# Altium project Inverter.PrjPcb
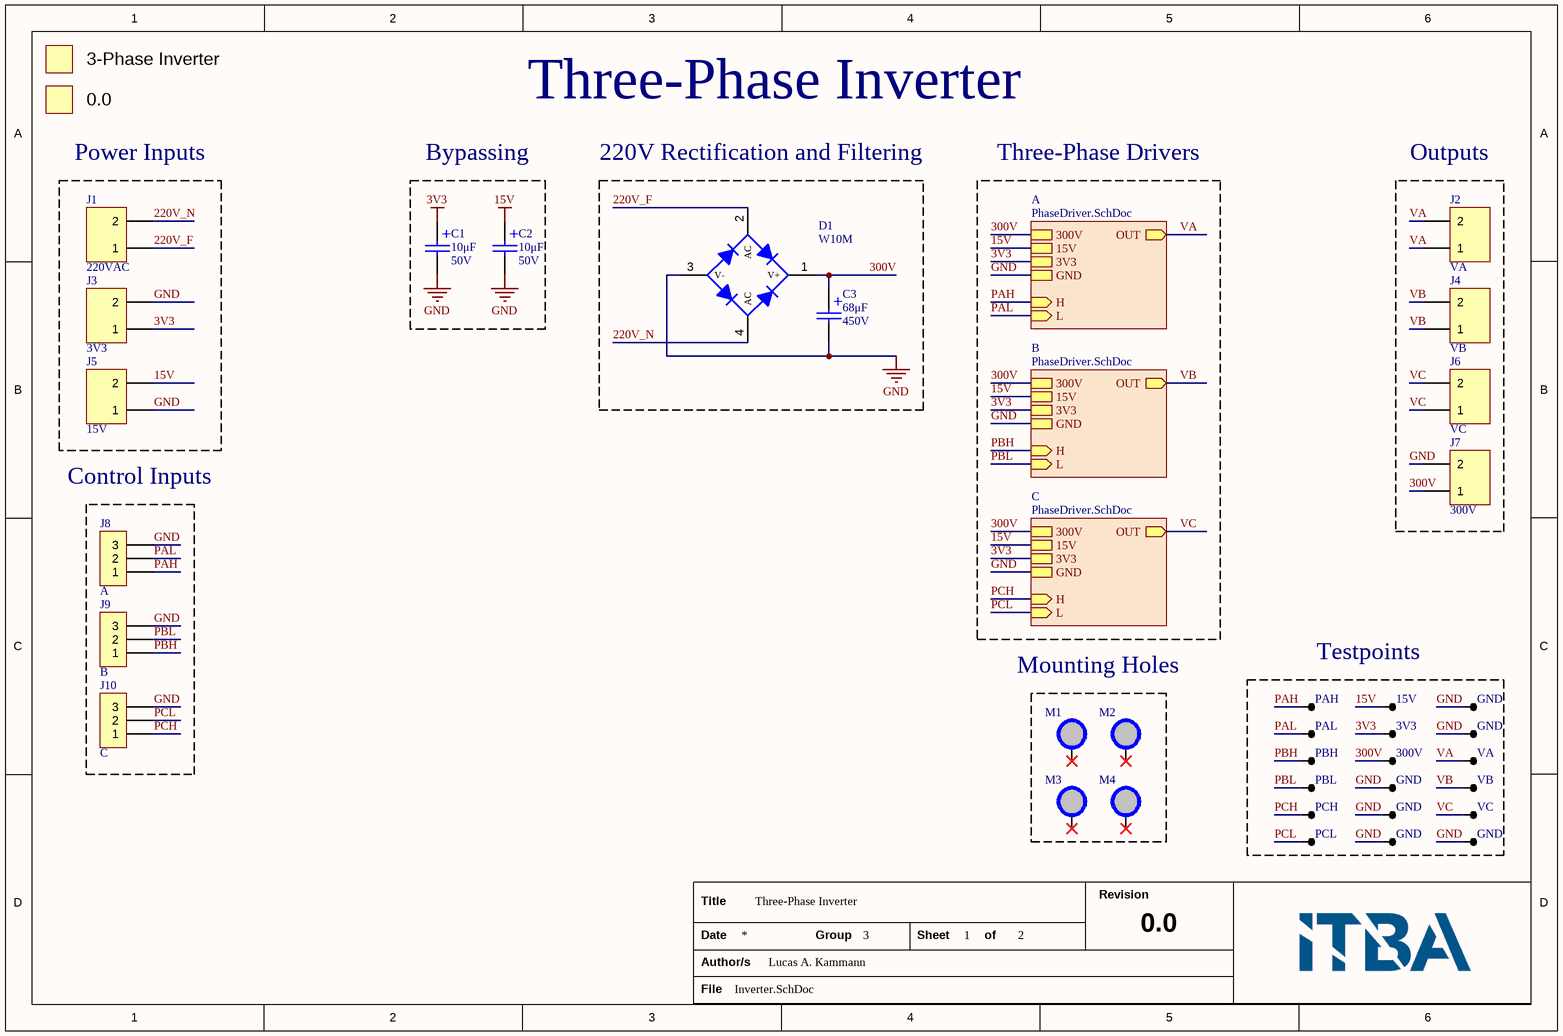
[diagram p0: Inverter.SchDoc]
2 sheets, 77 parts. Net scope: strictly hierarchical (ports join the sheet entries above them; power ports are local).
Board file: Inverter.PcbDoc
Sheets:
  Inverter.SchDoc
    A = PhaseDriver.SchDoc
    B = PhaseDriver.SchDoc
    C = PhaseDriver.SchDoc

## Sheet Inverter.SchDoc: Three-Phase Inverter
size 292 x 193 mm; Author: Lucas A. Kammann; DrawnBy: Lucas A. Kammann; Revision: 0.0; SheetNumber: 1; SheetTotal: 2; Project: Three-Phase Inverter; Authors: Lucas A. Kammann; Group: 3

### Parts
B1  Name: 3-Phase Inverter  [MISC_BOARD]  (hidden comment: Board Name)  (no BOM)
C1  value 10μF  Voltage Rating: 50V  [CAP100RP]  (hidden comment: CAPPOL)
C2  value 10μF  Voltage Rating: 50V  [CAP100RP]  (hidden comment: CAPPOL)
C3  value 68μF  Voltage Rating: 450V  [CAP_8mm]  (hidden comment: CAPPOL)
D1  W10M  [PUENTE - W10M]
J1  220VAC  [BORNERA2]
J2  VA  [BORNERA2]
J3  3V3  [BORNERA2]
J4  VB  [BORNERA2]
J5  15V  [BORNERA2]
J6  VC  [BORNERA2]
J7  300V  [BORNERA2]
J8  A  [SIP3]
J9  B  [SIP3]
J10  C  [SIP3]
M1  Mounting Hole  [MISC_MOUNTING_HOLE_M3]  (value not drawn)  (no BOM)
M2  Mounting Hole  [MISC_MOUNTING_HOLE_M3]  (value not drawn)  (no BOM)
M3  Mounting Hole  [MISC_MOUNTING_HOLE_M3]  (value not drawn)  (no BOM)
M4  Mounting Hole  [MISC_MOUNTING_HOLE_M3]  (value not drawn)  (no BOM)
TP1  PAH  [TPTH]
TP2  15V  [TPTH]
TP3  GND  [TPTH]
TP4  PAL  [TPTH]
TP5  3V3  [TPTH]
TP6  GND  [TPTH]
TP7  PBH  [TPTH]
TP8  300V  [TPTH]
TP9  VA  [TPTH]
TP10  PBL  [TPTH]
TP11  GND  [TPTH]
TP12  VB  [TPTH]
TP13  PCH  [TPTH]
TP14  GND  [TPTH]
TP15  VC  [TPTH]
TP16  PCL  [TPTH]
TP17  GND  [TPTH]
TP18  GND  [TPTH]
V1  Version: 0.0  [MISC_VERSION]  (hidden comment: PCB Version)  (no BOM)

### Blocks framed on the sheet
Power Inputs: J1 J3 J5
Bypassing: C1 C2
220V Rectification and Filtering: C3 D1
Outputs: J2 J4 J6 J7
Control Inputs: J8-J10
Mounting Holes: M1-M4
Testpoints: TP1-TP18

### Sub-sheets
A = PhaseDriver.SchDoc: 15V, 3V3, GND, H (in), L (in), OUT (out), 300V
B = PhaseDriver.SchDoc: 15V, 3V3, GND, H (in), L (in), OUT (out), 300V
C = PhaseDriver.SchDoc: 15V, 3V3, GND, H (in), L (in), OUT (out), 300V

### Nets
3V3: C1.1 J3.1 TP5.1 ; sheet A/3V3, sheet B/3V3, sheet C/3V3
15V: C2.1 J5.2 TP2.1 ; sheet A/15V, sheet B/15V, sheet C/15V
300V: C3.1 D1.1(V+) J7.1 TP8.1 ; sheet A/300V, sheet B/300V, sheet C/300V
GND: C1.2 C2.2 C3.2 D1.3(V-) J3.2 J5.1 J7.2 J8.3 J9.3 J10.3 TP3.1 TP6.1 TP11.1 TP14.1 TP17.1 TP18.1 ; sheet A/GND, sheet B/GND, sheet C/GND
220V_F: D1.2(AC) J1.1
220V_N: D1.4(AC) J1.2
PAH: J8.1 TP1.1 ; sheet A/H
PAL: J8.2 TP4.1 ; sheet A/L
PBH: J9.1 TP7.1 ; sheet B/H
PBL: J9.2 TP10.1 ; sheet B/L
PCH: J10.1 TP13.1 ; sheet C/H
PCL: J10.2 TP16.1 ; sheet C/L
VA: J2.1 J2.2 TP9.1 ; sheet A/OUT
VB: J4.1 J4.2 TP12.1 ; sheet B/OUT
VC: J6.1 J6.2 TP15.1 ; sheet C/OUT

Not connected (* = marked no-connect by the designer): M1 1*; M2 1*; M3 1*; M4 1*

### Notes on the sheet
- Three-Phase Inverter
- Three-Phase Drivers
- Title
- Revision
- Date
- Author/s
- Group
- Sheet
- of
- File
- (in symbol CAPACITOR POLARIZADO) +

### Library data of the parts
B1 = MISC_BOARD
C1-C3 = CAPACITOR POLARIZADO: Manufacturer Part Number: -; Manufacturer: -
J1-J7 = BORNERA 2: BORNERA 2 POLOS; Manufacturer Part Number: -; Manufacturer: -
J8-J10 = CON3
M1-M4 = MISC_MOUNTING_HOLE_M3: MOUNTING HOLE M2.5
TP1-TP18 = TP: TESTPOINT
V1 = MISC_VERSION

## Sheet PhaseDriver.SchDoc: Phase Driver
size 292 x 193 mm; Revision: 1.0; SheetNumber: 2; SheetTotal: 2; Project: Inverter
Used 3 times, as channels A, B, C. Parts and nets are listed once, with the designators drawn on the sheet.
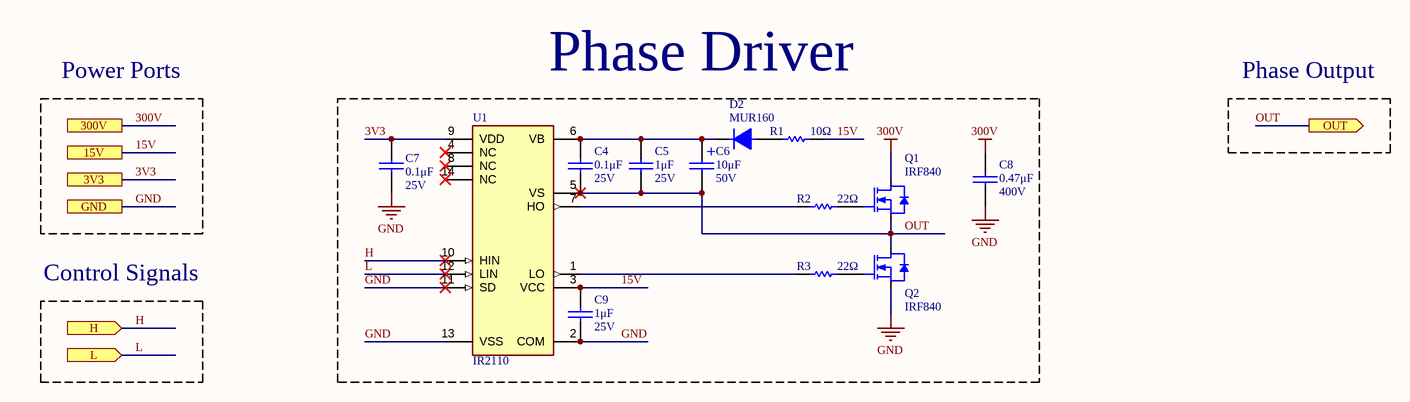
[diagram p1: PhaseDriver.SchDoc]

### Parts
C4  value 0.1μF  Voltage Rating: 25V  [0805]  (hidden comment: CAP)
C5  value 1μF  Voltage Rating: 25V  [CAP100]  (hidden comment: CAP)
C6  value 10μF  Voltage Rating: 50V  [CAP100RP]  (hidden comment: CAPPOL)
C7  value 0.1μF  Voltage Rating: 25V  [0805]  (hidden comment: CAP)
C8  value 0.47μF  Voltage Rating: 400V  [CAP600]  (hidden comment: CAP)
C9  value 1μF  Voltage Rating: 25V  [CAP100]  (hidden comment: CAP)
D2  MUR160  [DO41]
Q1  IRF840  [TO-220 V]
Q2  IRF840  [TO-220 V]
R1  value 10Ω  [0805]  (hidden comment: RES)
R2  value 22Ω  [0805]  (hidden comment: RES)
R3  value 22Ω  [0805]  (hidden comment: RES)
U1  IR2110  [IR2110]

### Blocks framed on the sheet
Phase Driver: C4-C9 D2 Q1 Q2 R1-R3 U1

### Ports
3V3, 15V, 300V, GND, H (in), L (in), OUT (out)

### Nets
300V: C8.1 Q1.2(D) ; port 300V
GND: C7.2 C8.2 C9.2 Q2.3(S) U1.2(COM) U1.11(SD) U1.13(VSS) ; port GND
3V3: C7.1 U1.9(VDD) ; port 3V3
15V: C9.1 R1.1 U1.3(VCC) ; port 15V
H: U1.10(HIN) ; port H
L: U1.12(LIN) ; port L
OUT: C4.2 C5.2 C6.2 Q1.3(S) Q2.2(D) U1.5(VS) ; port OUT
NetC4_1: C4.1 C5.1 C6.1 D2.2 U1.6(VB)
NetD2_1: D2.1 R1.2
NetQ1_1: Q1.1(G) R2.1
NetQ2_1: Q2.1(G) R3.1
NetR2_2: R2.2 U1.7(HO)
NetR3_2: R3.2 U1.1(LO)

Not connected (* = marked no-connect by the designer): U1 4(NC)* 8(NC)* 14(NC)*

### Channels
A: designators end in A; ports 3V3=3V3 15V=15V 300V=300V GND=GND H=PAH L=PAL OUT=VA
B: designators end in B; ports 3V3=3V3 15V=15V 300V=300V GND=GND H=PBH L=PBL OUT=VB
C: designators end in C; ports 3V3=3V3 15V=15V 300V=300V GND=GND H=PCH L=PCL OUT=VC

### Notes on the sheet
- Power Ports
- Phase Output
- Control Signals
- Title
- Revision
- Date
- Author/s
- Group
- Sheet
- of
- File
- (in symbol CAPACITOR POLARIZADO) +

### Library data of the parts
C4 C5 C7-C9 = CAPACITOR: Manufacturer: -; Manufacturer Part Number: -
C6 = CAPACITOR POLARIZADO: Manufacturer Part Number: -; Manufacturer: -
Q1 Q2 = IRF840: Manufacturer: Vishay; Value: IRF840; Manufacturer Part Number: IRF840
R1-R3 = RESISTOR: Power: 1/10W; Manufacturer Part Number: -; Manufacturer: -
U1 = IR2110: High and Low Side Driver; Manufacturer: Infineon Technologies; PackageReference: PG-DIP-14-903; Manufacturer Order Number: IR2110
D2 = MUR160: Manufacturer: *; Manufacturer Part Number: MUR160

## Nets that join several sheets
3V3: Inverter (C1.1 J3.1 TP5.1), A (C7A.1 U1A.9), B (C7B.1 U1B.9), C (C7C.1 U1C.9)
15V: Inverter (C2.1 J5.2 TP2.1), A (C9A.1 R1A.1 U1A.3), B (C9B.1 R1B.1 U1B.3), C (C9C.1 R1C.1 U1C.3)
300V: Inverter (C3.1 D1.1 J7.1 TP8.1), A (C8A.1 Q1A.2), B (C8B.1 Q1B.2), C (C8C.1 Q1C.2)
GND: Inverter (16 pins), A (7 pins), B (7 pins), C (7 pins)
PAH: Inverter (J8.1 TP1.1), A (U1A.10)
PAL: Inverter (J8.2 TP4.1), A (U1A.12)
PBH: Inverter (J9.1 TP7.1), B (U1B.10)
PBL: Inverter (J9.2 TP10.1), B (U1B.12)
PCH: Inverter (J10.1 TP13.1), C (U1C.10)
PCL: Inverter (J10.2 TP16.1), C (U1C.12)
VA: Inverter (J2.1 J2.2 TP9.1), A (6 pins)
VB: Inverter (J4.1 J4.2 TP12.1), B (6 pins)
VC: Inverter (J6.1 J6.2 TP15.1), C (6 pins)